# Altium schematic sheet POWER.SchDoc: =DocumentName
size 420 x 297 mm; CompanyName: "AS Manufacturing" LLC; Organization: "AS Manufacturing" LLC; Address1: 5 Sklyarenka St.; Address2: Kyiv 04073; Address3: Ukraine; Address4: https://ajax.systems/en/; DocumentNumber: 6; SheetNumber: 6; SheetTotal: 6; Template_version: 1.0.1
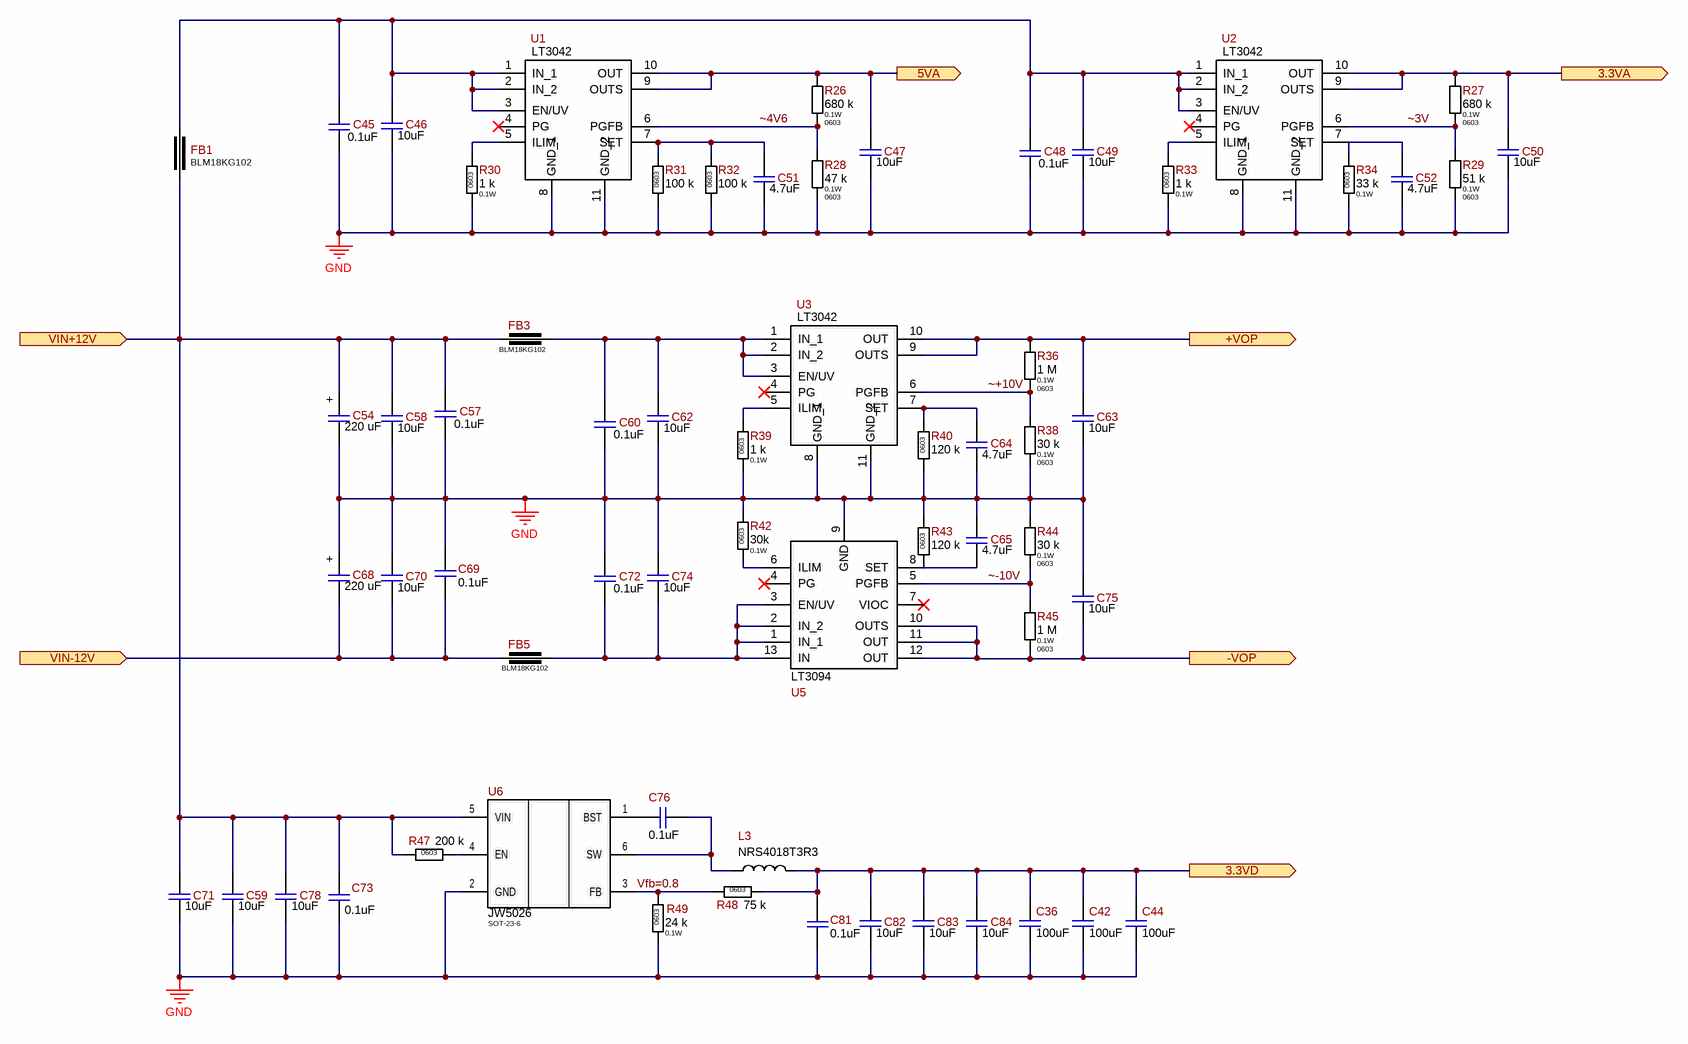
[diagram p0: POWER.SchDoc]

## Parts
C36  100uF  [C1206(3216)]
C42  100uF  [C1206(3216)]
C44  100uF  [C1206(3216)]
C45  0.1uF  [C0603(1608)]
C46  10uF  [C0805(2012)]
C47  10uF  [C0805(2012)]
C48  0.1uF  [C0603(1608)]
C49  10uF  [C0805(2012)]
C50  10uF  [C0805(2012)]
C51  4.7uF  [C0603(1608)]
C52  4.7uF  [C0603(1608)]
C54  220 uF  [CAP 8x9]
C57  0.1uF  [C0805(2012)]
C58  10uF  [C0805(2012)]
C59  10uF  [C0805(2012)]
C60  0.1uF  [C0603(1608)]
C62  10uF  [C0805(2012)]
C63  10uF  [C0805(2012)]
C64  4.7uF  [C0603(1608)]
C65  4.7uF  [C0603(1608)]
C68  220 uF  [CAP 8x9]
C69  0.1uF  [C0805(2012)]
C70  10uF  [C0805(2012)]
C71  10uF  [C0805(2012)]
C72  0.1uF  [C0603(1608)]
C73  0.1uF  [C0805(2012)]
C74  10uF  [C0805(2012)]
C75  10uF  [C0805(2012)]
C76  0.1uF  [C0603(1608)]
C78  10uF  [C0805(2012)]
C81  0.1uF  [C0805(2012)]
C82  10uF  [C0805(2012)]
C83  10uF  [C0805(2012)]
C84  10uF  [C0805(2012)]
FB1  BLM18KG102  [BLM18(0603)]
FB3  BLM18KG102  [BLM18(0603)]
FB5  BLM18KG102  [BLM18(0603)]
L3  NRS4018T3R3  [WE-LQS SMD 4018]
R26  680 k  Power Rating: 0.1W  Package/Case: 0603  [R0603]
R27  680 k  Power Rating: 0.1W  Package/Case: 0603  [R0603]
R28  47 k  Power Rating: 0.1W  Package/Case: 0603  [R0603]
R29  51 k  Power Rating: 0.1W  Package/Case: 0603  [R0603]
R30  1 k  Power Rating: 0.1W  Package/Case: 0603  [R0603]
R31  100 k  Package/Case: 0603  [R0603]
R32  100 k  Package/Case: 0603  [R0603]
R33  1 k  Power Rating: 0.1W  Package/Case: 0603  [R0603]
R34  33 k  Power Rating: 0.1W  Package/Case: 0603  [R0603]
R36  1 M  Power Rating: 0.1W  Package/Case: 0603  [R0603]
R38  30 k  Power Rating: 0.1W  Package/Case: 0603  [R0603]
R39  1 k  Power Rating: 0.1W  Package/Case: 0603  [R0603]
R40  120 k  Package/Case: 0603  [R0603]
R42  30k  Power Rating: 0.1W  Package/Case: 0603  [R0603]
R43  120 k  Package/Case: 0603  [R0603]
R44  30 k  Power Rating: 0.1W  Package/Case: 0603  [R0603]
R45  1 M  Power Rating: 0.1W  Package/Case: 0603  [R0603]
R47  200 k  Package/Case: 0603  [R0603]
R48  75 k  Package/Case: 0603  [R0603]
R49  24 k  Power Rating: 0.1W  Package/Case: 0603  [R0603]
U1  LT3042  [MSOP-10-EP]
U2  LT3042  [MSOP-10-EP]
U3  LT3042  [MSOP-10-EP]
U5  LT3094  [DFN-12]
U6  JW5026  Package: SOT-23-6  [SOT23-6]

## Ports
3.3VA (out), 3.3VD (out), 5VA (out), +VOP (out), -VOP (out), VIN+12V (in), VIN-12V (in)

## Nets
GND: C36.2 C42.2 C44.2 C45.1 C46.2 C47.2 C48.1 C49.2 C50.2 C51.2 C52.2 C54.2 C57.1 C58.2 C59.2 C60.1 C62.2 C63.2 C64.2 C65.1 C68.1 C69.2 C70.1 C71.2 C72.2 C73.1 C74.1 C75.1 C78.2 C81.1 C82.2 C83.2 C84.2 R28.1 R29.1 R30.1 R31.1 R32.1 R33.1 R34.1 R38.2 R39.1 R40.1 R42.2 R43.2 R44.1 R49.1 U1.8(GND_1) U1.11(GND_2) U2.8(GND_1) U2.11(GND_2) U3.8(GND_1) U3.11(GND_2) U5.9(GND) U6.2(GND)
3.3VA: C50.1 R27.2 U2.9(OUTS) U2.10(OUT) ; port 3.3VA
3.3VD: C36.1 C42.1 C44.1 C81.2 C82.1 C83.1 C84.1 L3.2 R48.2 ; port 3.3VD
5VA: C47.1 R26.2 U1.9(OUTS) U1.10(OUT) ; port 5VA
+VOP: C63.1 R36.1 U3.9(OUTS) U3.10(OUT) ; port +VOP
-VOP: C75.2 R45.2 U5.10(OUTS) U5.11(OUT) U5.12(OUT) ; port -VOP
Vfb=0.8: R48.1 R49.2 U6.3(FB)
VIN+12V: C54.1 C57.2 C58.1 C59.1 C71.1 C73.2 C78.1 FB1.1 FB3.1 R47.1 U6.5(VIN) ; port VIN+12V
VIN-12V: C68.2 C69.1 C70.2 FB5.1 ; port VIN-12V
~3V: R27.1 R29.2 U2.6(PGFB)
~4V6: R26.1 R28.2 U1.6(PGFB)
~+10V: R36.2 R38.1 U3.6(PGFB)
~-10V: R44.2 R45.1 U5.5(PGFB)
NetC45_2: C45.2 C46.1 C48.2 C49.1 FB1.2 U1.1(IN_1) U1.2(IN_2) U1.3(EN/UV) U2.1(IN_1) U2.2(IN_2) U2.3(EN/UV)
NetC51_1: C51.1 R31.2 R32.2 U1.7(SET)
NetC52_1: C52.1 R34.2 U2.7(SET)
NetC60_2: C60.2 C62.1 FB3.2 U3.1(IN_1) U3.2(IN_2) U3.3(EN/UV)
NetC64_1: C64.1 R40.2 U3.7(SET)
NetC65_2: C65.2 R43.1 U5.8(SET)
NetC72_1: C72.1 C74.2 FB5.2 U5.1(IN_1) U5.2(IN_2) U5.3(EN/UV) U5.13(IN)
NetC76_1: C76.1 U6.1(BST)
NetC76_2: C76.2 L3.1 U6.6(SW)
NetR30_2: R30.2 U1.5(ILIM)
NetR33_2: R33.2 U2.5(ILIM)
NetR39_2: R39.2 U3.5(ILIM)
NetR42_1: R42.1 U5.6(ILIM)
NetR47_2: R47.2 U6.4(EN)

Not connected (* = marked no-connect by the designer): U1 4(PG)*; U2 4(PG)*; U3 4(PG)*; U5 4(PG)* 7(VIOC)*

## Notes on the sheet
- Vout=0.1xR
- 1
- 2
- 3
- 4
- 5
- 6
- 7
- 8
- A
- B
- C
- D
- E
- F
- Назва проекту
- Мова
- UA
- Розробник
- Формат
- A3
- Версія
- Дата
- Лист
- /
- (in symbol 220 uF  16V 8 x 9) +

## Library data of the parts
C36 C42 C44 = 100uF  10V С1206: CAP CER 100UF 10V X5T 1206; Name Component: Capacitor Ceramic; Tolerance: ±20%; Operation Temperature: -55°C ~ 105°C; Temperature Coefficient: X5R; Library Path 1: Capacitors.SchLib; Part Number: 100uF  10V С1206; Value: 100uF; Power (V/A): 10V; Package/Case: С1206; Supplier 1: Digi-key; ComponentLink1Description: Datasheet
C45 C48 C60 C72 C76 = 0.1uF  50V C0603: CAP CER 0.1UF 50V X7R 0603; Manufacturer: Samsung Electro-Mechanics; Manufacturer P/N: CL10B104KB8WPNC; Name Component: Capacitor Ceramic; Tolerance: ±10%; Operation Temperature: -55°C ~ 125°C; Notes: 06035C104K4T4A, 06035C104K4T2A; Library Path 1: Capacitors.SchLib; Part Number: 0.1uF  50V C0603; Value: 0.1uF; Temperature Coefficient: X7R; Power (V/A): 50V; Package/Case: C0603; Supplier 1: Digi-key; Supplier Part Number 1: 1276-6854-2-ND; ComponentLink1Description: Datasheet; ComponentLink1URL: https://www.samsungsem.com/resources/file/global/support/product_catalog/MLCC.pdf
C46 C47 C49 C50 C58 C59 C62 C63 C70 C71 C74 C75 C78 C82-C84 = 10uF  25V C0805: CAP CER 10UF 25V X5R 0805; Manufacturer: Murata Electronics North America; Manufacturer P/N: GRM21BR61E106KA73L; Name Component: Capacitor Ceramic; Tolerance: ±10%; Operation Temperature: -55°C ~ 105°C; Library Path 1: Capacitors.SchLib; Notes: GRM21BR61E106KA73K, 08053D106KAT2A; Part Number: 10uF  25V C0805; Value: 10uF; Temperature Coefficient: X5R; Power (V/A): 25V; Package/Case: C0805; Supplier 1: Digi-key; Supplier Part Number 1: 490-5523-2-ND; ComponentLink1Description: Datasheet; ComponentLink1URL: https://www.murata.com/~/media/webrenewal/support/library/catalog/products/capacitor/mlcc/c02e.ashx?la=en-us
C51 C52 C64 C65 = 4.7uF  25V C0603: CAP CER 4.7UF 25V X6S 0603; Manufacturer: Murata Electronics North America; Manufacturer P/N: GRM188C81E475KE11D; Name Component: Capacitor Ceramic; Tolerance: ±10%; Operation Temperature: -55°C ~ 105°C; Library Path 1: Capacitors.SchLib; Notes: GRM188C81E475KE11J; Part Number: 4.7uF  25V C0603; Value: 4.7uF; Temperature Coefficient: X6S; Power (V/A): 25V; Package/Case: C0603; Supplier 1: Digi-key; Supplier Part Number 1: 490-7199-2-ND; ComponentLink1Description: Datasheet; ComponentLink1URL: https://www.murata.com/~/media/webrenewal/support/library/catalog/products/capacitor/mlcc/c02e.ashx?la=en-us
C54 C68 = 220 uF  16V 8 x 9: CAP POLY 220 UF 20% 16V 8x9; Manufacturer: Leaguer; Manufacturer P/N: VPT1C221M0809; Name Component: Conductive Polymer Aluminum Solid Capacitors; Operation Temperature: -55°C ~ 105°C; Library Path 1: Capacitors.SchLib; Part Number: 220 uF  16V 8 x 9; Value: 220 uF; Tolerance: ±20%; Temperature Coefficient: -; Power (V/A): 16V; Package/Case: 8 x 9; Supplier 1: RCS; Supplier Part Number 1: 124733; ComponentLink1Description: Datasheet; ComponentLink1URL: https://www.rcscomponents.kiev.ua/datasheets/kks4700608x9-datasheet.pdf
C57 C69 C73 C81 = 0.1uF  50V C0805: CAP CER 0.1UF 50V X7R 0805; Manufacturer: AVX Corporation; Manufacturer P/N: 08055C104KAT2A; Name Component: Capacitor Ceramic; Tolerance: ±10%; Operation Temperature: -55°C ~ 105°C; Notes: 08055C104KAT4A,08055C104KAJ2A, 08055C104KAJ4A; Library Path 1: Capacitors.SchLib; Part Number: 0.1uF  50V C0805; Value: 0.1uF; Temperature Coefficient: X7R; Power (V/A): 50V; Package/Case: C0805; Supplier 1: Digi-key; Supplier Part Number 1: 478-1395-2-ND; ComponentLink1Description: Datasheet; ComponentLink1URL: http://catalogs.avx.com/SurfaceMount.pdf
FB1 FB3 FB5 = BLM18KG102: FERRITE BEAD 1 KOHM 0603 1LN; Manufacturer: Murata Electronics North America; Manufacturer P/N: BLM18KG102SN1D; Name Component: Ferrite Beads; Tolerance: ±25%; Power (V/A): 1A; Library Path 1: Inductance.SchLib; Part Number: BLM18KG102; Value: BLM18KG102; Package/Case: 0603 (1608 Metric); Supplier 1: Digi-key; Supplier Part Number 1: 490-17349-2-ND; ComponentLink1Description: Datasheet; ComponentLink1URL: https://media.digikey.com/pdf/Data%20Sheets/Murata%20PDFs/BLM18yyyyyyN1x.pdf
L3 = NRS4018T3R3: FIXED IND 3.3UH 2A 66 MOHM SMD; Manufacturer: TaiyoYuden; Manufacturer P/N: NRS4018T3R3MDGJ; Name Component: Fixed Inductors; Tolerance: ±20; Operation Temperature: -25°C ~ 120°C; Library Path 1: Inductance.SchLib; Part Number: NRS4018T3R3; Value: NRS4018T3R3; Power (V/A): 2A; Package/Case: 4.00mm x 4.00mm; Supplier 1: Digi-key; Supplier Part Number 1: 587-2892-2-ND; ComponentLink1Description: Datasheet; ComponentLink1URL: https://www.yuden.co.jp/productdata/catalog/wound04_e.pdf
R26 R27 = 680 k  R0603: RES SMD 680 k OHM  ±1% 1/10W 0603; Name Component: Resistror; Operation Temperature: -55℃ to 155℃; Temperature Coefficient: ±100 ppm/°C; Library Path 1: Resistor.SchLib; Part Number: 680 k  R0603; Value: 680 k; Tolerance: ±1%
R28 = 47 k  R0603: RES SMD 47 k OHM  ±1% 1/10W 0603; Name Component: Resistror; Operation Temperature: -55℃ to 155℃; Temperature Coefficient: ±100 ppm/°C; Library Path 1: Resistor.SchLib; Part Number: 47 k  R0603; Value: 47 k; Tolerance: ±1%
R29 = 51 k  R0603: RES SMD 51 k OHM  ±1% 1/10W 0603; Name Component: Resistror; Operation Temperature: -55℃ to 155℃; Temperature Coefficient: ±100 ppm/°C; Library Path 1: Resistor.SchLib; Part Number: 51 k  R0603; Value: 51 k; Tolerance: ±1%
R30 R33 R39 = 1 k  R0603: RES SMD 1 k OHM  ±1% 1/10W 0603; Name Component: Resistror; Operation Temperature: -55℃ to 155℃; Temperature Coefficient: ±100 ppm/°C; Library Path 1: Resistor.SchLib; Part Number: 1 k  R0603; Value: 1 k; Tolerance: ±1%
R31 R32 = 100 k  R0603: RES SMD 100 k OHM  ±1% 1/10W 0603; Power Rating: 0.1W; Name Component: Resistror; Operation Temperature: -55℃ to 155℃; Temperature Coefficient: ±100 ppm/°C; Library Path 1: Resistor.SchLib; Part Number: 100 k  R0603; Value: 100 k; Tolerance: ±1%
R34 = 33 k  R0603: RES SMD 33 k OHM  ±1% 1/10W 0603; Name Component: Resistror; Operation Temperature: -55℃ to 155℃; Temperature Coefficient: ±100 ppm/°C; Library Path 1: Resistor.SchLib; Part Number: 33 k  R0603; Value: 33 k; Tolerance: ±1%
R36 R45 = 1 M  R0603: RES SMD 1 M OHM  ±1% 1/10W 0603; Name Component: Resistror; Operation Temperature: -55℃ to 155℃; Temperature Coefficient: ±100 ppm/°C; Library Path 1: Resistor.SchLib; Part Number: 1 M  R0603; Value: 1 M; Tolerance: ±1%
R38 R44 = 30 k  R0603: RES SMD 30 k OHM  ±1% 1/10W 0603; Name Component: Resistror; Operation Temperature: -55℃ to 155℃; Temperature Coefficient: ±100 ppm/°C; Library Path 1: Resistor.SchLib; Part Number: 30 k  R0603; Value: 30 k; Tolerance: ±1%
R40 R43 = 120 k  R0603: RES SMD 120 k OHM  ±1% 1/10W 0603; Power Rating: 0.1W; Name Component: Resistror; Operation Temperature: -55℃ to 155℃; Temperature Coefficient: ±100 ppm/°C; Library Path 1: Resistor.SchLib; Part Number: 120 k  R0603; Value: 120 k; Tolerance: ±1%
R42 = 120 k  R0603: RES SMD 120 k OHM  ±1% 1/10W 0603; Name Component: Resistror; Value: 120 k; Operation Temperature: -55℃ to 155℃; Temperature Coefficient: ±100 ppm/°C; Library Path 1: Resistor.SchLib; Part Number: 120 k  R0603; Tolerance: ±1%
R47 = 200 k  R0603: RES SMD 200 k OHM  ±1% 1/10W 0603; Power Rating: 0.1W; Name Component: Resistror; Operation Temperature: -55℃ to 155℃; Temperature Coefficient: ±100 ppm/°C; Library Path 1: Resistor.SchLib; Part Number: 200 k  R0603; Value: 200 k; Tolerance: ±1%
R48 = 75 k  R0603: RES SMD 75 k OHM  ±1% 1/10W 0603; Power Rating: 0.1W; Name Component: Resistror; Operation Temperature: -55℃ to 155℃; Temperature Coefficient: ±100 ppm/°C; Library Path 1: Resistor.SchLib; Part Number: 75 k  R0603; Value: 75 k; Tolerance: ±1%
R49 = 24 k  R0603: RES SMD 24 k OHM  ±1% 1/10W 0603; Name Component: Resistror; Operation Temperature: -55℃ to 155℃; Temperature Coefficient: ±100 ppm/°C; Library Path 1: Resistor.SchLib; Part Number: 24 k  R0603; Value: 24 k; Tolerance: ±1%
U1-U3 = LT3042: Linear Voltage Regulator IC Positive Adjustable 1 Output 200mA 10-MSOP-EP 117dB ~ 56dB (120Hz ~ 10MHz); Manufacturer_Name: Analog Devices; Manufacturer_Part_Number: LT3042IMSE#PBF; Operation Temperature: -40°C ~ 125°C (TJ); Power (V/A): 2 - 20V; Library Path 1: Power converters.SchLib; ComponentDescription: Linear Voltage Regulator LT3042  (10-MSOP-EP); Datasheet Link: https://www.analog.com/media/en/technical-documentation/data-sheets/3042fb.pdf; Height: 1.1mm; Mouser Part Number: 584-LT3042IMSE#PBF; Mouser Price/Stock: https://www.mouser.co.uk/ProductDetail/Analog-Devices/LT3042IMSEPBF?qs=oahfZPh6IAKNLbWsEo0jgA%3D%3D; Arrow Part Number: LT3042IMSE#PBF; Arrow Price/Stock: https://www.arrow.com/en/products/lt3042imsepbf/analog-devices?utm_currency=USD&region=europe; Part Number: LT3042; Name Component: Linear Voltage Regulator; Value: LT3042; Package/Case: 10-MSOP-EP; Supplier 1: Digi-key; Supplier Part Number 1: LT3042IMSE#PBF; ComponentLink1Description: Datasheet; ComponentLink1URL: https://www.analog.com/media/en/technical-documentation/data-sheets/3042fb.pdf
U5 = LT3094: Linear Voltage Regulator IC Negative Adjustable 1 Output 500mA 12-DFN (3x3) 108dB ~ 28dB (120Hz ~ 10MHz); Manufacturer_Name: Analog Devices; Manufacturer_Part_Number: LT3042IMSE#PBF; Manufacturer: Analog Devices Inc.; Manufacturer P/N: LT3094EDD#TRPBF; Operation Temperature: -40°C ~ 125°C (TJ); Power (V/A): -2.3…-19.4V; Library Path 1: Power converters.SchLib; ComponentDescription: Linear Voltage Regulator LT3094  (12-DFN (3x3)); Datasheet Link: https://www.analog.com/media/en/technical-documentation/data-sheets/3042fb.pdf; Height: 1.1mm; Mouser Part Number: 584-LT3042IMSE#PBF; Mouser Price/Stock: https://www.mouser.co.uk/ProductDetail/Analog-Devices/LT3042IMSEPBF?qs=oahfZPh6IAKNLbWsEo0jgA%3D%3D; Arrow Part Number: LT3042IMSE#PBF; Arrow Price/Stock: https://www.arrow.com/en/products/lt3042imsepbf/analog-devices?utm_currency=USD&region=europe; Part Number: LT3094; Name Component: Linear Voltage Regulator; Value: LT3094; Package/Case: 12-DFN (3x3); Supplier 1: Digi-key; Supplier Part Number 1: 505-LT3094EDD#TRPBFTR-ND; ComponentLink1Description: Datasheet; ComponentLink1URL: https://www.analog.com/media/en/technical-documentation/data-sheets/LT3094.pdf
U6 = JW5026: Switching Voltage Regulators 4.7V to 40V Input, 1A Output , Vfb = 0.6V VStep-Down Converter SOT-23-6; Manufacturer: Joulwatt Technology; Name Component: Power converters; Operation Temperature: -40°C ~ 125°C (TJ); Power (V/A): 4.7…40V 2A; Library Path 1: Power converters.SchLib; ComponentDescription: Power converters JW5026  (SOT 23-6); ComponentLink1URL: https://www.skytech.ir/DownLoad/File/2588_JW5026.pdf; ComponentLink1Description: Datasheet; Part Number: JW5026; Value: JW5026; Package/Case: SOT 23-6; Supplier 1: Kosmodrom; Supplier Part Number 1: JW5026